# Altium schematic sheet 03-LED-GREEN.SchDoc: Green LEDs
size A; Revision: A; SheetNumber: 3; SheetTotal: 10; ECE315_Project_Name: ECE315 F23 Wack-A-Mole
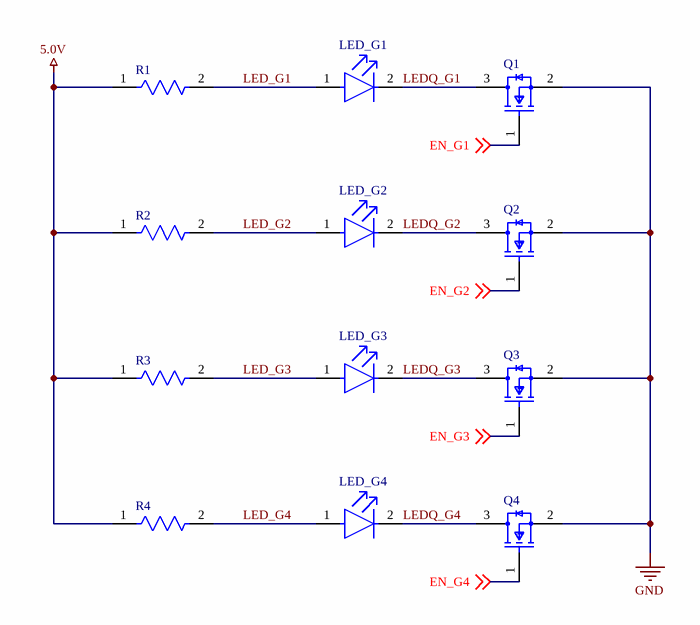
[diagram p0: 03-LED-GREEN.SchDoc]

## Parts
LED_G1  SML-LX1206GC-TR  [FP-SML-LX1206GC-TR-MFG]  (value not drawn)
LED_G2  SML-LX1206GC-TR  [FP-SML-LX1206GC-TR-MFG]  (value not drawn)
LED_G3  SML-LX1206GC-TR  [FP-SML-LX1206GC-TR-MFG]  (value not drawn)
LED_G4  SML-LX1206GC-TR  [FP-SML-LX1206GC-TR-MFG]  (value not drawn)
Q1  2N7002-7-F  [FP-SOT23-MFG]  (value not drawn)
Q2  2N7002-7-F  [FP-SOT23-MFG]  (value not drawn)
Q3  2N7002-7-F  [FP-SOT23-MFG]  (value not drawn)
Q4  2N7002-7-F  [FP-SOT23-MFG]  (value not drawn)
R1  CRCW1206330RFKEA  [FP-CRCW1206-e3-IPC_A]  (value not drawn)
R2  CRCW1206330RFKEA  [FP-CRCW1206-e3-IPC_A]  (value not drawn)
R3  CRCW1206330RFKEA  [FP-CRCW1206-e3-IPC_A]  (value not drawn)
R4  CRCW1206330RFKEA  [FP-CRCW1206-e3-IPC_A]  (value not drawn)

## Nets
5.0V: R1.1 R2.1 R3.1 R4.1
GND: Q1.2(S) Q2.2(S) Q3.2(S) Q4.2(S)
EN_G1: Q1.1(G) ; off-sheet EN_G1
EN_G2: Q2.1(G) ; off-sheet EN_G2
EN_G3: Q3.1(G) ; off-sheet EN_G3
EN_G4: Q4.1(G) ; off-sheet EN_G4
LED_G1: LED_G1.1(A) R1.2
LED_G2: LED_G2.1(A) R2.2
LED_G3: LED_G3.1(A) R3.2
LED_G4: LED_G4.1(A) R4.2
LEDQ_G1: LED_G1.2(C) Q1.3(D)
LEDQ_G2: LED_G2.2(C) Q2.3(D)
LEDQ_G3: LED_G3.2(C) Q3.3(D)
LEDQ_G4: LED_G4.2(C) Q4.3(D)

## Notes on the sheet
- Title:
- Size:
- A
- Project
- Rev:
- Sheet:
- of
- College of Engineering
- 1415 Engineering Drive
- Madison, WI 53706

## Library data of the parts
LED_G1-LED_G4 = CMP-2000-07122-2: LED GREEN CLEAR 1206 SMD; Test Current: 20mA; Luminous Intensity: 10mcd; Forward Voltage: 2.2V; Viewing Angle: 160°; Lens Color: Colorless; Approvals: UL; Dominant Wavelength: 565nm; Current Rating: 25mA; Number of LEDs: 1; Power Rating: 65mW; Lens Style: Rectangular; Length: 3.2mm; Mount: Surface Mount; Package Quantity: 1; Forward Current: 20mA; Case/Package: 1206; Lead Free: Lead Free; Case Code (Imperial): 1206; Max Operating Temperature: 85°C; REACH SVHC: No SVHC; RoHS Compliant: Yes; Number of Pins: 2; Illumination Color: Green; Width: 1.6mm; Packaging: Tape and Reel; Wavelength: 565nm; Lens Transparency: Clear; Height: 1.1mm; Color: Green; Min Operating Temperature: -40°C; Case Code (Metric): 3216
Q1-Q4 = CMP-2000-04929-2: MOSFET N-CH 60V 115MA SOT23-3; Turn-On Delay Time: 7ns; Turn-Off Delay Time: 11ns; Drain to Source Resistance: 7.5R; Rise Time: 3ns; Drain to Source Breakdown Voltage: 70V; Input Capacitance: 50pF; Number of Elements: 1; Power Dissipation: 540mW; Max Power Dissipation: 300mW; Fall Time: 5.6ns; Gate to Source Voltage (Vgs): 20V; Threshold Voltage: 2.5V; Element Configuration: Single; Termination: SMD/SMT; Weight: 0.000282oz; Radiation Hardening: No; Max Operating Temperature: 150°C; On-State Resistance: 7.5R; Mount: Surface Mount; Current Rating: 115mA; Contact Plating: Tin; Lead Free: Lead Free; Min Operating Temperature: -55°C; Number of Pins: 3; REACH SVHC: No SVHC; Drain to Source Voltage (Vdss): 60V; Width: 1.3mm; Package Quantity: 3000; Length: 2.9mm; Case/Package: SOT-23; Number of Channels: 1; Dual Supply Voltage: 60V; Packaging: Tape and Reel; Height: 1mm; Voltage Rating (DC): 60V; Nominal Vgs: 2.5V; Continuous Drain Current (ID): 115mA; Voltage: 60V; Rds On Max: 7.5R
R1-R4 = CMP-2003-02098-2: RES Thick Film, 330Ω, 1%, 0.25W, 100ppm/°C, 1206; Voltage Rating: 200V; Resistance: 330R; Max Power Dissipation: 250mW; Height: 0.55mm; Mount: Surface Mount; Min Operating Temperature: -55°C; Depth: 1.6mm; Features: Automotive AEC-Q200; Voltage Rating (DC): 200V; Military Standard: Not; Packaging: Tape and Reel; Composition: Thick Film; Contact Plating: Tin; Case Code (Imperial): 1206; Case/Package: 1206; Number of Terminations: 2; Length: 3.2mm; Lead Free: Lead Free; Tolerance: 1%; Temperature Coefficient: 100ppm/°C; Case Code (Metric): 3216; Width: 1.6mm; Weight: 0.000353oz; Termination: SMD/SMT; Radiation Hardening: No; Package Quantity: 10; Power Rating: 250mW; Max Operating Temperature: 155°C